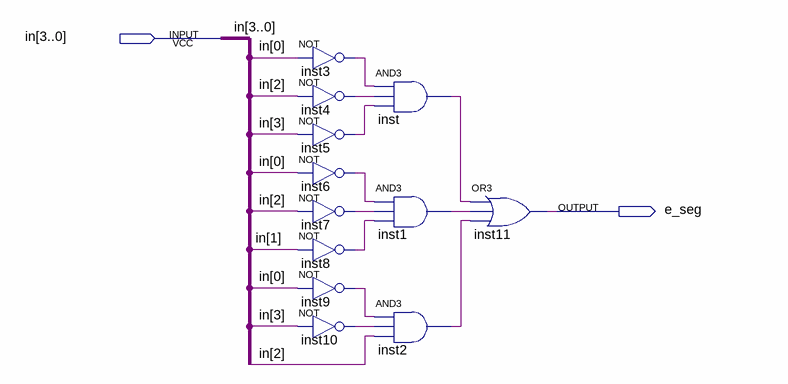
[diagram p0: schematic sheet]
// Quartus schematic e_seg_org.bdf as structural Verilog: 12 symbols, 2 pins
module e_seg_org (
  input  [3:0] in,
  output e_seg
);

  wire inst1_out, inst2_out, inst3_out, inst4_out, inst5_out, inst6_out, inst7_out, inst8_out, inst9_out,
       inst10_out, inst_out;

  not inst3 (inst3_out, in[0]);
  not inst4 (inst4_out, in[2]);
  not inst5 (inst5_out, in[3]);
  not inst6 (inst6_out, in[0]);
  not inst7 (inst7_out, in[2]);
  not inst8 (inst8_out, in[1]);
  not inst9 (inst9_out, in[0]);
  not inst10 (inst10_out, in[3]);
  and inst (inst_out, inst3_out, inst4_out, inst5_out);
  and inst1 (inst1_out, inst6_out, inst7_out, inst8_out);
  and inst2 (inst2_out, inst9_out, inst10_out, in[2]);
  or inst11 (e_seg, inst_out, inst1_out, inst2_out);
endmodule
